# Altium schematic sheet schematic.schdoc
size 289 x 188 mm
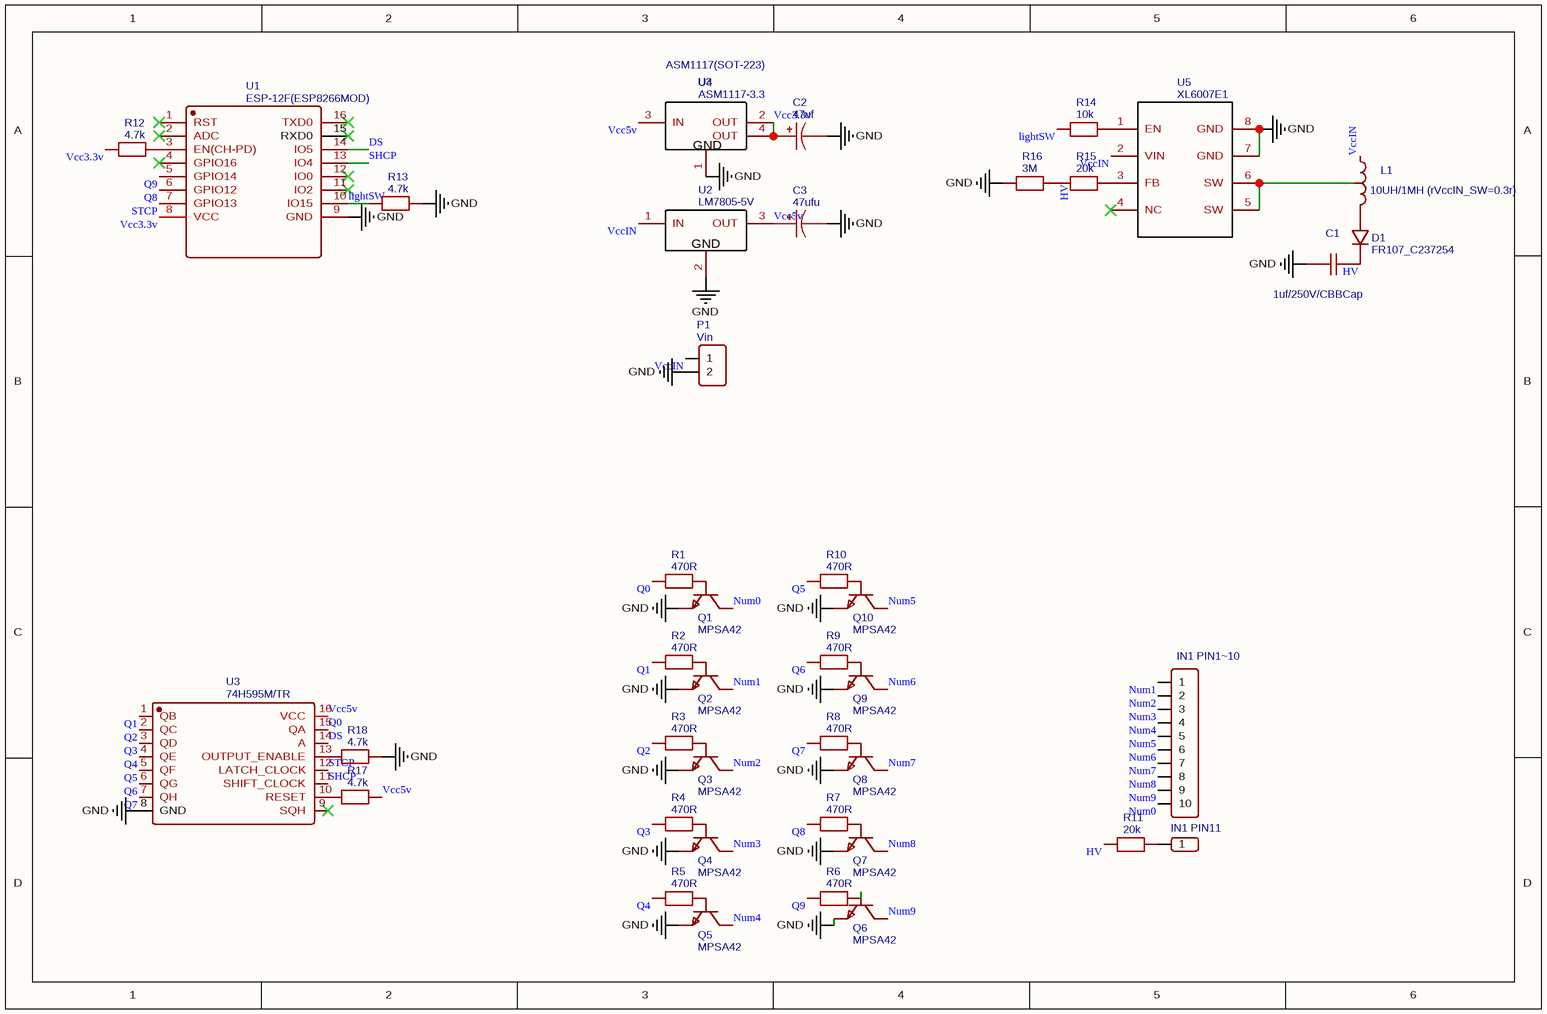
[diagram p0: schematic.schdoc]

## Parts
C1  1uf/250V/CBBCap  [CAP-TH_L17.0-W8.5-P15.00-D1.2-FD]
C2  47uf  [CASE-A_3216]
C3  47ufu  [CASE-A_3216]
D1  FR107_C237254  [DO-41_BD2.4-L4.7-P8.70-D0.9-RD]
H1  IN1 PIN1~10  [HDR-F-2.54_1X10]
J1  IN1 PIN11  [HDR-M-2.54_1X1]
L1  10UH/1MH (rVccIN_SW=0.3r)  [立插三脚电感]
P1  Vin  [CONN-TH_2P-P5.00]
Q1  MPSA42  [TO-92-3_L4.9-W3.7-P1.27-L]
Q2  MPSA42  [TO-92-3_L4.9-W3.7-P1.27-L]
Q3  MPSA42  [TO-92-3_L4.9-W3.7-P1.27-L]
Q4  MPSA42  [TO-92-3_L4.9-W3.7-P1.27-L]
Q5  MPSA42  [TO-92-3_L4.9-W3.7-P1.27-L]
Q6  MPSA42  [TO-92-3_L4.9-W3.7-P1.27-L]
Q7  MPSA42  [TO-92-3_L4.9-W3.7-P1.27-L]
Q8  MPSA42  [TO-92-3_L4.9-W3.7-P1.27-L]
Q9  MPSA42  [TO-92-3_L4.9-W3.7-P1.27-L]
Q10  MPSA42  [TO-92-3_L4.9-W3.7-P1.27-L]
R1  470R  [R0603]
R2  470R  [R0603]
R3  470R  [R0603]
R4  470R  [R0603]
R5  470R  [R0603]
R6  470R  [R0603]
R7  470R  [R0603]
R8  470R  [R0603]
R9  470R  [R0603]
R10  470R  [R0603]
R11  20k  [R0603]
R12  4.7k  [R0603]
R13  4.7k  [R0603]
R14  10k  [R0603]
R15  20k  [R0603]
R16  3M  [R0603]
R17  4.7k  [R0603]
R18  4.7k  [R0603]
U1  ESP-12F(ESP8266MOD)  [WIFIM-SMD_ESP-12F-ESP8266MOD]
U2  LM7805-5V  [TO-252-2_L6.6-W6.1-P4.58-LS9.9-TL]
U3  74H595M/TR
U4  ASM1117-3.3  [ASM1117-3.3]
U5  XL6007E1  [SOIC-8_L5.0-W4.0-P1.27-LS6.0-BL]

## Nets
GND: C1.2 C2.2 C3.2 P1.2 Q1.1(E) Q2.1(E) Q3.1(E) Q4.1(E) Q5.1(E) Q6.1(E) Q7.1(E) Q8.1(E) Q9.1(E) Q10.1(E) R13.2 R16.1 R18.2 U1.9(GND) U2.2(GND) U3.8(GND) U4.1(ADJ) U5.7(GND) U5.8(GND)
DS: U1.14(IO5) U3.14(A)
HV: C1.1 D1.1(K) R11.1 R15.1 R16.2
lightSW: R13.1 R14.1 U1.10(IO15)
Num0: H1.10 Q1.3(C)
Num1: H1.1 Q2.3(C)
Num2: H1.2 Q3.3(C)
Num3: H1.3 Q4.3(C)
Num4: H1.4 Q5.3(C)
Num5: H1.5 Q10.3(C)
Num6: H1.6 Q9.3(C)
Num7: H1.7 Q8.3(C)
Num8: H1.8 Q7.3(C)
Num9: H1.9 Q6.3(C)
Q0: R1.2 U3.15(QA)
Q1: R2.2 U3.1(QB)
Q2: R3.2 U3.2(QC)
Q3: R4.2 U3.3(QD)
Q4: R5.2 U3.4(QE)
Q5: R10.2 U3.5(QF)
Q6: R9.2 U3.6(QG)
Q7: R8.2 U3.7(QH)
Q8: R7.2 U1.6(GPIO12)
Q9: R6.2 U1.5(GPIO14)
SHCP: U1.13(IO4) U3.11(SHIFT_CLOCK)
STCP: U1.7(GPIO13) U3.12(LATCH_CLOCK)
Vcc3.3v: C2.1 R12.2 U1.8(VCC) U4.2(OUT) U4.4(OUT)
Vcc5v: C3.1 R17.2 U2.3(OUT) U3.16(VCC) U4.3(IN)
VccIN: L1.3 P1.1 U2.1(IN) U5.2(VIN)
NetD1_2: D1.2(A) L1.2
NetJ1_1: J1.1 R11.2
NetL1_1: L1.1 U5.5(SW) U5.6(SW)
NetQ1_2: Q1.2(B) R1.1
NetQ2_2: Q2.2(B) R2.1
NetQ3_2: Q3.2(B) R3.1
NetQ4_2: Q4.2(B) R4.1
NetQ5_2: Q5.2(B) R5.1
NetQ6_2: Q6.2(B) R6.1
NetQ7_2: Q7.2(B) R7.1
NetQ8_2: Q8.2(B) R8.1
NetQ9_2: Q9.2(B) R9.1
NetQ10_2: Q10.2(B) R10.1
NetR12_1: R12.1 U1.3(EN(CH-PD))
NetR14_2: R14.2 U5.1(EN)
NetR15_2: R15.2 U5.3(FB)
NetR17_1: R17.1 U3.10(RESET)
NetR18_1: R18.1 U3.13(OUTPUT_ENABLE)

Not connected (* = marked no-connect by the designer): U1 1(RST)* 2(ADC)* 4(GPIO16)* 11(IO2)* 12(IO0)* 15(RXD0)* 16(TXD0)*; U3 9(SQH)*; U5 4(NC)*

## Notes on the sheet
- (in symbol ASM1117-3.3) ASM1117(SOT-223); U3; GND

## Library data of the parts
C1 = 1uf/250V/CBBCap: BOM_Manufacturer: ReliaPro; BOM_Manufacturer Part: 1uf/250V/CBBCapacitor; Value: 1uF; BOM_Supplier Part: C29321; BOM_Supplier: LCSC; spicePre: C; spiceSymbolName: 1uf/250V/CBBCapacitor
C2 = 47uf: nameAlias: Value(F); Contributor: LCEDA_Lib; spicePre: C; spiceSymbolName: C_Tan_SMD_A_US
C3 = 47ufu: nameAlias: Value(F); Contributor: LCEDA_Lib; spicePre: C; spiceSymbolName: C_Tan_SMD_A_US
D1 = FR107_C237254: BOM_Manufacturer: HL; BOM_Manufacturer Part: FR107; Contributor: LCSC; BOM_Supplier: LCSC; BOM_Supplier Part: C237254; BOM_JLCPCB Part Class: Extended Part; spicePre: D; spiceSymbolName: FR107_C237254
H1 = IN1 PIN1~10: Contributor: LCEDA_Lib; BOM_Supplier Part: C35445; BOM_Supplier: LCSC; spicePre: H; spiceSymbolName: HDR-F-2.54_1x10
J1 = IN1 PIN11: Contributor: LCEDA_Lib; BOM_Supplier Part: C81276; BOM_Supplier: LCSC; spicePre: J; spiceSymbolName: HDR-M-2.54_1x1
L1 = 10UH/1MH (rVccIN_SW=0.3r): Contributor: NKB-NB; spicePre: L; spiceSymbolName: 三脚电感/立插
P1 = Vin: Contributor: LCEDA_Lib; BOM_Supplier: LCSC; spicePre: P; spiceSymbolName: CONN-TH_2P-P5.00
Q1-Q10 = MPSA42: BOM_Manufacturer: SEMTECH; Contributor: LCSC; BOM_Supplier: LCSC; BOM_Manufacturer Part: MPSA42; BOM_Supplier Part: C118557; BOM_JLCPCB Part Class: Extended Part; spicePre: Q; spiceSymbolName: MPSA42
R1-R10 = 470R: nameAlias: Value(Ω); Contributor: LCEDA_Lib; spicePre: R; spiceSymbolName: R_0603_EU
R11 R15 = 20k: nameAlias: Value(Ω); Contributor: LCEDA_Lib; spicePre: R; spiceSymbolName: R_0603_EU
R12 R13 R17 R18 = 4.7k: nameAlias: Value(Ω); Contributor: LCEDA_Lib; spicePre: R; spiceSymbolName: R_0603_EU
R14 = 10k: nameAlias: Value(Ω); Contributor: LCEDA_Lib; spicePre: R; spiceSymbolName: R_0603_EU
R16 = 3M: nameAlias: Value(Ω); Contributor: LCEDA_Lib; spicePre: R; spiceSymbolName: R_0603_EU
U1 = ESP-12F(ESP8266MOD): BOM_Manufacturer: Ai-Thinker; Contributor: Diago; BOM_Supplier: LCSC; BOM_Manufacturer Part: ESP-12F(ESP8266MOD); BOM_Supplier Part: C82891; spicePre: U; spiceSymbolName: ESP-12F(ESP8266MOD)
U2 = LM7805-5V: BOM_Manufacturer: null; Contributor: LCSC; BOM_Supplier: LCSC; BOM_Supplier Part: C9900008050; BOM_Manufacturer Part: LM7805-5V; spicePre: U; spiceSymbolName: LM7805-5V
U3 = 74H595M/TR: Contributor: lianan; spicePre: U; spiceSymbolName: 74H595M/TR
U4 = ASM1117-3.3: Contributor: shiznegjie; spicePre: U; spiceSymbolName: ASM1117-3.3
U5 = XL6007E1: BOM_Manufacturer: XLSEMI; Contributor: roco2022; BOM_Supplier: LCSC; BOM_Manufacturer Part: XL6007E1; BOM_Supplier Part: C73334; BOM_JLCPCB Part Class: Extended Part; spicePre: U; spiceSymbolName: XL6007E1